# EAGLE design esp32buscam_01 (EAGLE 9.6.2)
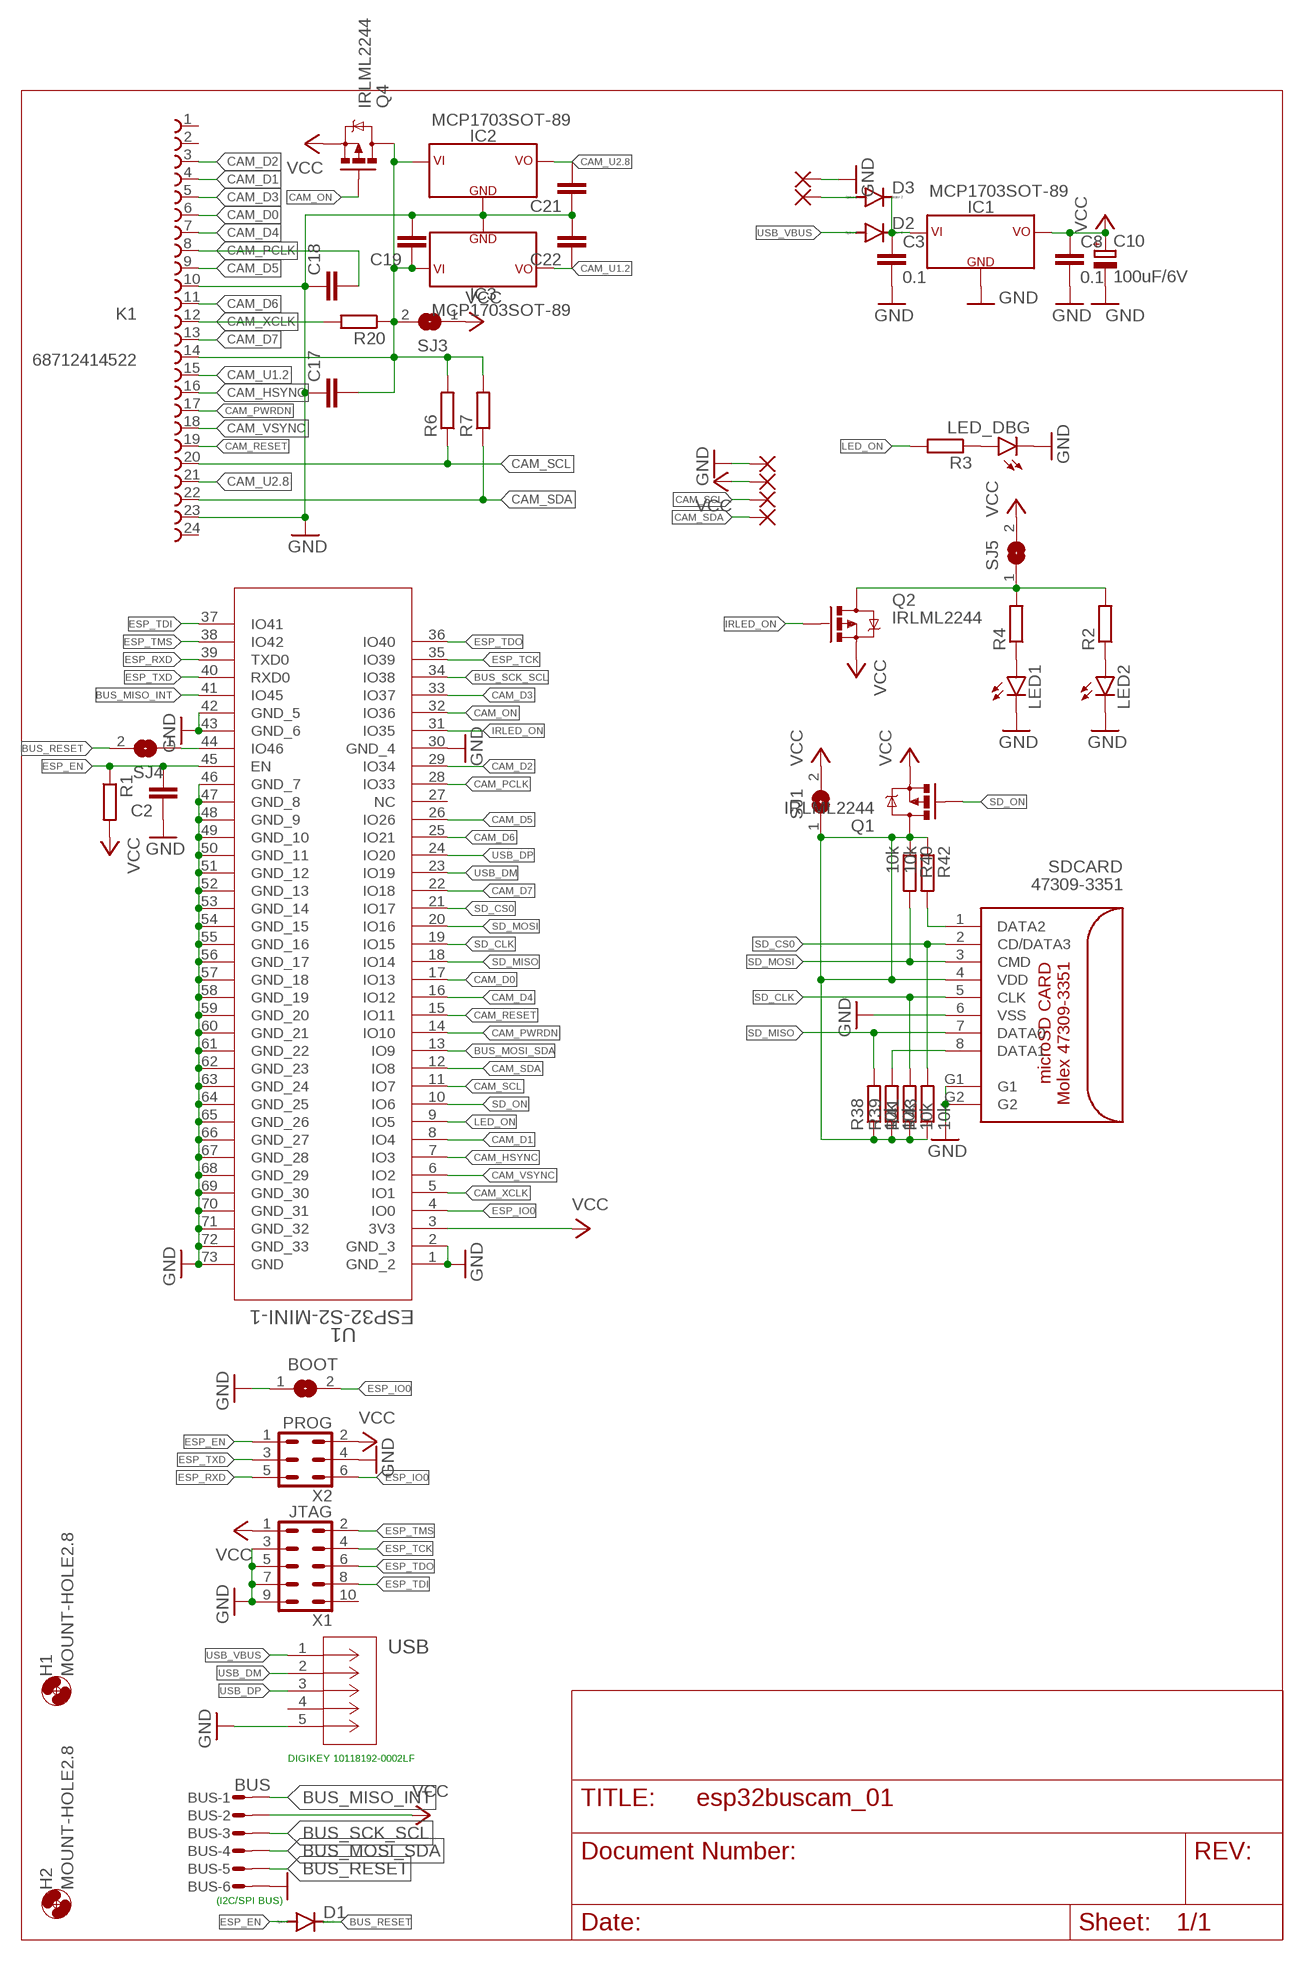
[diagram p0: schematic, sheet 1]

## Parts
BOOT  SJ  [SJ]
BUS  BUS  MICROMATCH-6SMD  [MICROMATCH-6SMD]
C2  C-EUC0603  [C0603]
C3  0.1  C-EUC0805  [C0805]
C8  0.1  C-EUC0805  [C0805]
C10  100uF/6V  CPOL-EUB/3528-21R  [B/3528-21R]
C17  C-EUC0603  [C0603]
C18  C-EUC0603  [C0603]
C19  C-EUC0603  [C0603]
C21  C-EUC0603  [C0603]
C22  C-EUC0603  [C0603]
D1  DIODE-MINIMELF  [MINIMELF]
D2  DIODE-MINIMELF  [MINIMELF]
D3  DIODE-MINIMELF  [MINIMELF]
H1  MOUNT-HOLE2.8  [2,8]
H2  MOUNT-HOLE2.8  [2,8]
IC1  MCP1703SOT-89  [SOT89]
IC2  MCP1703SOT-89  [SOT89]
IC3  MCP1703SOT-89  [SOT89]
K1  68712414522  [68712414522]
LED1  LED5MM  [LED5MM]
LED2  LED5MM  [LED5MM]
LED_DBG  G  LEDCHIPLED_0805  [CHIPLED_0805]
PAD1  1,6/0,9  [1,6/0,9]
PAD2  1,6/0,9  [1,6/0,9]
PAD3  1,6/0,9  [1,6/0,9]
PAD4  1,6/0,9  [1,6/0,9]
PAD5  1,6/0,9  [1,6/0,9]
PAD6  1,6/0,9  [1,6/0,9]
Q1  IRLML2244  MOSFET-PCHANNELIRLML2244  [SOT23-3]
Q2  IRLML2244  MOSFET-PCHANNELIRLML2244  [SOT23-3]
Q4  IRLML2244  MOSFET-PCHANNELIRLML2244  [SOT23-3]
R1  R-EU_R0603  [R0603]
R2  R-EU_R0402  [R0402]
R3  R-EU_R0402  [R0402]
R4  R-EU_R0402  [R0402]
R6  R-EU_R0603  [R0603]
R7  R-EU_R0603  [R0603]
R20  R-EU_R0603  [R0603]
R38  10k  R-EU_R0805  [R0805]
R39  10k  R-EU_R0805  [R0805]
R40  10k  R-EU_R0805  [R0805]
R41  10k  R-EU_R0805  [R0805]
R42  10k  R-EU_R0805  [R0805]
R43  10k  R-EU_R0805  [R0805]
SDCARD  47309-3351  [47309-3351]
SJ1  SJ  [SJ]
SJ3  SJ  [SJ]
SJ4  SJ  [SJ]
SJ5  SJ  [SJ]
U1  ESP32-S2-MINI-1  [QFN60_ESP32-S2-MINI-1_EXP]
USB  10118192-0002LF  [CONN_10118192-0002LF_AMP]
X1  JTAG  PHB_1MM27_2X05_SNS  [PHB_1MM27_2X05_SNS]
X2  PROG  PHB_1MM27_2X03_SNS  [PHB_1MM27_2X03_SNS]

## Nets
BUS_MISO_INT: BUS.1 U1.41(IO45)
BUS_MOSI_SDA: BUS.4 U1.13(IO9)
BUS_RESET: BUS.5 D1.C SJ4.2
BUS_SCK_SCL: BUS.3 U1.34(IO38)
CAM_D0: K1.6 U1.17(IO13)
CAM_D1: K1.4 U1.8(IO4)
CAM_D2: K1.3 U1.29(IO34)
CAM_D3: K1.5 U1.33(IO37)
CAM_D4: K1.7 U1.16(IO12)
CAM_D5: K1.9 U1.26(IO26)
CAM_D6: K1.11 U1.25(IO21)
CAM_D7: K1.13 U1.22(IO18)
CAM_HSYNC: K1.16 U1.7(IO3)
CAM_ON: Q4.1(G) U1.32(IO36)
CAM_PCLK: C18.2 K1.8 U1.28(IO33)
CAM_PWRDN: K1.17 U1.14(IO10)
CAM_RESET: K1.19 U1.15(IO11)
CAM_SCL: K1.20 PAD3.1(P) R6.1 U1.11(IO7)
CAM_SDA: K1.22 PAD4.1(P) R7.1 U1.12(IO8)
CAM_U1.2: C22.1 IC3.3(VCC) K1.15
CAM_U2.8: C21.2 IC2.3(VCC) K1.21
CAM_VSYNC: K1.18 U1.6(IO2)
CAM_XCLK: K1.12 R20.2 U1.5(IO1)
ESP_EN: C2.2 D1.A R1.1 U1.45(EN) X2.1
ESP_IO0: BOOT.2 U1.4(IO0) X2.6
ESP_RXD: U1.39(TXD0) X2.5
ESP_TCK: U1.35(IO39) X1.4
ESP_TDI: U1.37(IO41) X1.8
ESP_TDO: U1.36(IO40) X1.6
ESP_TMS: U1.38(IO42) X1.2
ESP_TXD: U1.40(RXD0) X2.3
GND [gnd]: BOOT.1 BUS.6 C2.1 C3.2 C8.2 C10.- C17.1 C18.1 C19.2 C21.1 C22.2 IC1.1(GND) IC2.1(GND) IC3.1(GND) K1.10 K1.23 LED1.K(C) LED2.K(C) LED_DBG.C PAD1.1(P) PAD6.1(P) SDCARD.6(VSS) SDCARD.G1 SDCARD.G2 U1.1(GND_2) U1.2(GND_3) U1.30(GND_4) U1.42(GND_5) U1.43(GND_6) U1.46(GND_7) U1.47(GND_8) U1.48(GND_9) U1.49(GND_10) U1.50(GND_11) U1.51(GND_12) U1.52(GND_13) U1.53(GND_14) U1.54(GND_15) U1.55(GND_16) U1.56(GND_17) U1.57(GND_18) U1.58(GND_19) U1.59(GND_20) U1.60(GND_21) U1.61(GND_22) U1.62(GND_23) U1.63(GND_24) U1.64(GND_25) U1.65(GND_26) U1.66(GND_27) U1.67(GND_28) U1.68(GND_29) U1.69(GND_30) U1.70(GND_31) U1.71(GND_32) U1.72(GND_33) U1.73(GND) USB.5 X1.3 X1.5 X1.7 X1.9 X2.4
IRLED_ON: Q2.1(G) U1.31(IO35)
LED_ON: R3.2 U1.9(IO5)
N$1: LED1.A R4.1
N$2: SJ4.1 U1.44(IO46)
N$3: LED2.A R2.1
N$4: LED_DBG.A R3.1
N$8: Q2.3(D) R2.2 R4.2 SJ5.1
SD_CLK: R41.2 SDCARD.5(CLK) U1.19(IO15)
SD_CS0: R43.2 SDCARD.2(CD/DATA3) U1.21(IO17)
SD_D1: R39.2 SDCARD.8(DATA1)
SD_D2: R42.2 SDCARD.1(DATA2)
SD_MISO: R38.2 SDCARD.7(DATA0) U1.18(IO14)
SD_MOSI: R40.2 SDCARD.3(CMD) U1.20(IO16)
SD_ON: Q1.1(G) U1.10(IO6)
U3.3 [power]: Q1.3(D) R38.1 R39.1 R40.1 R41.1 R42.1 R43.1 SDCARD.4(VDD) SJ1.1
USB_DM: U1.23(IO19) USB.2
USB_DP: U1.24(IO20) USB.3
USB_VBUS [power]: D2.A USB.1
V [power]: C3.1 D2.C D3.C IC1.2(VIN) IC1.4(VIN)
VCC [power]: BUS.2 C8.1 C10.+ IC1.3(VCC) PAD2.1(P) Q1.2(S) Q2.2(S) Q4.2(S) R1.2 SJ1.2 SJ3.1 SJ5.2 U1.3(3V3) X1.1 X2.2
VCC_CAM [power]: C17.2 C19.1 IC2.2(VIN) IC2.4(VIN) IC3.2(VIN) IC3.4(VIN) K1.14 Q4.3(D) R6.2 R7.2 R20.1 SJ3.2
VEXT: D3.A PAD5.1(P)
Unconnected: K1.1 K1.2 K1.24 U1.27(NC) USB.4 X1.10

## Notes on the sheet
- DIGIKEY 10118192-0002LF
- (I2C/SPI BUS)

## Library data of the parts
BOOT SJ1 SJ3-SJ5 = jumper:SJ: SMD solder JUMPER
BUS = con-amp-micromatch:MICROMATCH-6: MicroMaTch 6 7-215464-6 / 0-215464-6 Drawing Number C-215464 DDEController.pdf
C2 C17-C19 C21 C22 = rcl:C-EU: CAPACITOR, European symbol; SPICEPREFIX: C
C3 C8 = rcl:C-EU: CAPACITOR, European symbol
C10 = rcl:CPOL-EU: POLARIZED CAPACITOR, European symbol
D1-D3 = diode:DIODE-: DIODE
H1 H2 = holes:MOUNT-HOLE: MOUNTING HOLE with drill center marker
IC1-IC3 = bytewerk-vreg:MCP1703
K1 = FPC_Connectors_Flat_Flexible_Cable_rev15c:68712414522: WE-FPC 0.5mm SMT ZIF Horizontal Bottom Contact, 24 Pins=>Code : Con_FPC_ZIF_0.50_68712414522 <http://katalog.we-online.de/media/images/eican/Con_FPC_ZIF_0.50_6871xx14522_pf2.jpg> Details see: http://katalog.we-online.de/en/em/687_1xx_145_22 Created 2014-07-09, Karrer Zheng 2014 (C) Würth Elektronik
LED1 LED2 LED_DBG = led:LED: LED OSRAM: - CHIPLED LG R971, LG N971, LY N971, LG Q971, LY Q971, LO R971, LY R971 LH N974, LH R974 LS Q976, LO Q976, LY Q976 LO Q996 - Hyper CHIPLED LW Q18S LB Q993, LB Q99A, LB R99A - SideLED LS A670, LO A670, LY A670, LG A670, LP A670 LB A673, LV A673, LT A673, LW A673 LH A674 LY A675 LS A676, LA A676, LO A676, LY A676, LW A676 LS A679, LY A679, LG A679 - Hyper Micro SIDELED® LS Y876, LA Y876, LO Y876, LY Y876 LT Y87S - SmartLED LW L88C, LW L88S LB L89C, LB L89S, LG L890 LS L89K, LO L89K, LY L89K LS L896, LA L896, LO L896, LY L896 - TOPLED LS T670, LO T670, LY T670, LG T670, LP T670 LSG T670, LSP T670, LSY T670, LOP T670, LYG T670 LG T671, LOG T671, LSG T671 LB T673, LV T673, LT T673, LW T673 LH T674 LS T676, LA T676, LO T676, LY T676, LB T676, LH T676, LSB T676, LW T676 LB T67C, LV T67C, LT T67C, LS T67K, LO T67K, LY T67K, LW E67C LS E67B, LA E67B, LO E67B, LY E67B, LB E67C, LV E67C, LT E67C LW T67C LS T679, LY T679, LG T679 LS T770, LO T770, LY T770, LG T770, LP T770 LB T773, LV T773, LT T773, LW T773 LH T774 LS E675, LA E675, LY E675, LS T675 LS T776, LA T776, LO T776, LY T776, LB T776 LHGB T686 LT T68C, LB T68C - Hyper Mini TOPLED® LB M676 - Mini TOPLED Santana® LG M470 LS M47K, LO M47K, LY M47K Source: http://www.osram.convergy.de LUXEON: - LUMILED® LXK2-PW12-R00, LXK2-PW12-S00, LXK2-PW14-U00, LXK2-PW14-V00 LXK2-PM12-R00, LXK2-PM12-S00, LXK2-PM14-U00 LXK2-PE12-Q00, LXK2-PE12-R00, LXK2-PE12-S00, LXK2-PE14-T00, LXK2-PE14-U00 LXK2-PB12-K00, LXK2-PB12-L00, LXK2-PB12-M00, LXK2-PB14-N00, LXK2-PB14-P00, LXK2-PB14-Q00 LXK2-PR12-L00, LXK2-PR12-M00, LXK2-PR14-Q00, LXK2-PR14-R00 LXK2-PD12-Q00, LXK2-PD12-R00, LXK2-PD12-S00 LXK2-PH12-R00, LXK2-PH12-S00 LXK2-PL12-P00, LXK2-PL12-Q00, LXK2-PL12-R00 Source: www.luxeon.com KINGBRIGHT: KA-3528ASYC Source: www.kingbright.com
PAD1-PAD6 = wirepad:1,6/0,9: THROUGH-HOLE PAD
Q1 Q2 Q4 = User-Submitted:MOSFET-PCHANNEL: Generic PMOSFET IRLML2244 - TRANS-11153 (SOT-23 -20V -4.3A) (1.Gate 2.Source 3.Drain) FQP27P06 - COM-10349 <http://www.sparkfun.com/products/10349> (TO-220 -60V -27A) (1.Gate 2.Source 3.Drain); PROD_ID: TRANS-11153
R1-R4 R6 R7 R20 = rcl:R-EU_: RESISTOR, European symbol; SPICEPREFIX: R
R38-R43 = rcl:R-EU_: RESISTOR, European symbol
SDCARD = con-molex-microsd:47309-3351
U1 = esp32s2mini:ESP32-S2-MINI-1; BUILT_BY: EMA_Kyle; COPYRIGHT: Copyright (C) 2018 Accelerated Designs. All rights reserved; DATASHEET: https://www.espressif.com/sites/default/files/documentation/esp32-s2-mini-1_esp32-s2-mini-1u_datasheet_en.pdf; MANUFACTURER_PART_NUMBER: ESP32-S2-MINI-1; SOURCELIBRARY: Add_to_database_2020-11-03; VENDOR: Espressif Systems
USB = esp32s2mini:10118192-0002LF; BUILT_BY: EMA_Cory; COPYRIGHT: Copyright (C) 2018 Accelerated Designs. All rights reserved; DATASHEET: https://www.amphenol-icc.com/media/wysiwyg/files/drawing/10118192.pdf; MANUFACTURER_PART_NUMBER: 10118192-0002LF; SOURCELIBRARY: Amphenol_ICC_2020-05-19; VENDOR: Amphenol
X1 = _hhn_con_pinhead_box_1mm27:PHB_1MM27_2X05_*: Pin Header Box-Type, 1.27mm/0.5"/50mil Pitch, 2x05 Circuits Note: see library description for an important note about THT-version
X2 = _hhn_con_pinhead_box_1mm27:PHB_1MM27_2X03_*: Pin Header Box-Type, 1.27mm/0.5"/50mil Pitch, 2x03 Circuits Note: see library description for an important note about THT-version

## Net classes
0 default: width 0.089 mm, drill 0.2 mm
1 gnd: width 0.254 mm, drill 0.2 mm
2 power: width 0.254 mm, drill 0.2 mm

## Board
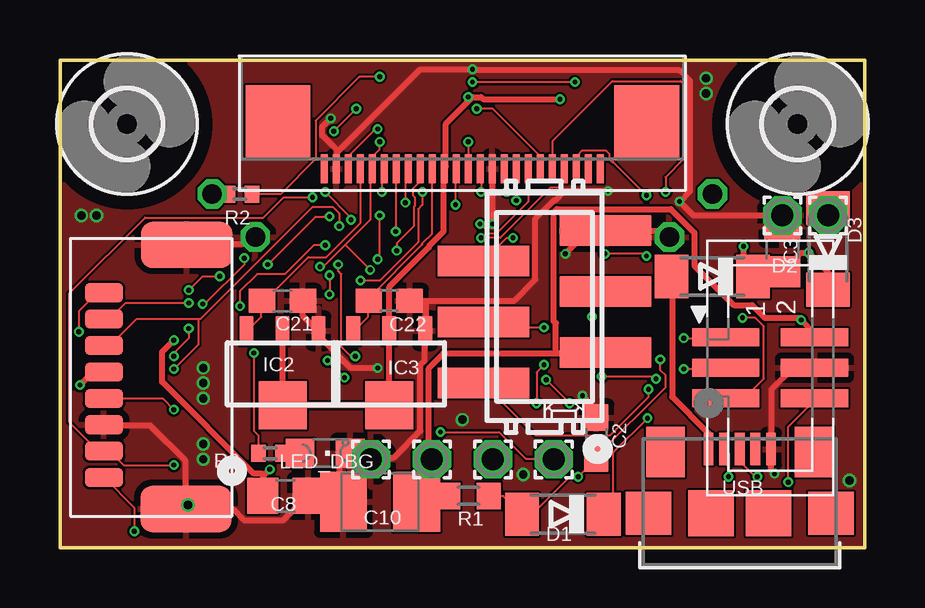
[diagram p1: board, top side]
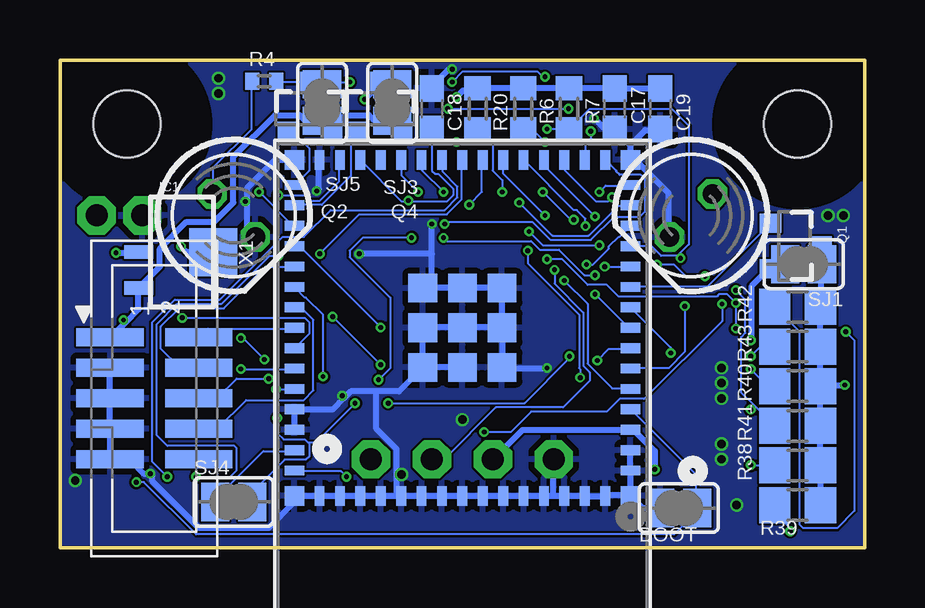
[diagram p2: board, bottom side, seen from below]

Size 33.53 x 20.32 mm. Coordinates in mm from the lower left corner, seen from the top.
Outline: 0,0 33.53,0 33.53,20.32 0,20.32 0,0
Copper layers (1*16): Top 0.035mm / dielectric 0.2mm / Bottom 0.035mm
Design rules "jlcpcb-2-layer *": minimum track width 3.5mil, minimum drill 0.2mm, track to track 3.5mil, track to pad 5mil, pad to pad 5mil, via to via 5mil, smd to smd 0mil, copper to edge 0.01mm, drill to drill 5mil, minimum pad ring 4mil, minimum via ring 4mil, stop-mask expansion 3mil, vias tented up to drill 100mil, thermal gap 10mil

### Footprints (pad centres in the part's own frame; a part is rotated, then mirrored left to right if it is on the bottom)
SJ = smd 1.168 x 1.6: 1 -0.762,0; 2 0.762,0
MICROMATCH-6SMD = smd 1.27 x 3.81: 1 3.175,-2.54; 2 1.905,2.54; 3 0.635,-2.54; 4 -0.635,2.54; 5 -1.905,-2.54; 6 -3.175,2.54
C0603 = smd 1.1 x 1: 1 -0.85,0; 2 0.85,0
C0805 = smd 1.3 x 1.5: 1 -0.95,0; 2 0.95,0
B/3528-21R = smd 1.95 x 2.5: + 1.525,0; - -1.525,0
MINIMELF = smd 1.4 x 1.8: A 1.7,0; C -1.7,0
2,8 = hole 2.8: 0,0
SOT89 = smd 0.58 x 1.2: 1 -1.5,-1.8; 2 0,-1.8; 3 1.5,-1.8 | smd 2 x 2: 4 0,1.3
68712414522 = smd 0.3 x 1.2: 1 -5.75,0.6; 2 -5.25,0.6; 3 -4.75,0.6; 4 -4.25,0.6; 5 -3.75,0.6; 6 -3.25,0.6; 7 -2.75,0.6; 8 -2.25,0.6; 9 -1.75,0.6; 10 -1.25,0.6; 11 -0.75,0.6; 12 -0.25,0.6; 13 0.25,0.6; 14 0.75,0.6; 15 1.25,0.6; 16 1.75,0.6; 17 2.25,0.6; 18 2.75,0.6; 19 3.25,0.6; 20 3.75,0.6; 21 4.25,0.6; 22 4.75,0.6; 23 5.25,0.6; 24 5.75,0.6 | smd 2.7 x 3: Z1 -7.68,-1.38; Z2 7.68,-1.38
LED5MM = drill 0.813 octagon: A -1.27,0; K 1.27,0
CHIPLED_0805 = smd 1.2 x 1.2: A 0,-1.05; C 0,1.05
1,6/0,9 = drill 0.914 pad 1.6 octagon: 1 0,0
SOT23-3 = smd 0.8 x 0.9: 1 -0.95,-1; 2 0.95,-1; 3 0,1.1
R0603 = smd 1 x 1.1: 1 -0.85,0; 2 0.85,0
R0402 = smd 0.6 x 0.7: 1 -0.5,0; 2 0.5,0
R0805 = smd 1.3 x 1.5: 1 -0.95,0; 2 0.95,0
47309-3351 = smd 0.8 x 1.6: 1 4.4,5.66; 2 3.3,5.66; 3 2.2,5.66; 4 1.1,5.66; 5 0,5.66; 6 -1.1,5.66; 7 -2.2,5.66; 8 -3.3,5.66 | smd 1.93 x 3.81: G1 -4.61,2.24; G2 6.393,2.217
QFN60_ESP32-S2-MINI-1_EXP = smd 0.813 x 0.406: 1 -7,3.645; 2 -7,2.795; 3 -7,1.945; 4 -7,1.095; 5 -7,0.245; 6 -7,-0.605; 7 -7,-1.455; 8 -7,-2.305; 9 -7,-3.155; 10 -7,-4.005; 11 -7,-4.855; 12 -7,-5.705; 13 -7,-6.555; 14 -7,-7.405; 15 -7,-8.255; 31 7,-8.255; 32 7,-7.405; 33 7,-6.555; 34 7,-5.705; 35 7,-4.855; 36 7,-4.005; 37 7,-3.155; 38 7,-2.305; 39 7,-1.455; 40 7,-0.605; 41 7,0.245; 42 7,1.095; 43 7,1.945; 44 7,2.795; 45 7,3.645 | smd 0.406 x 0.813: 16 -5.95,-9.305; 17 -5.1,-9.305; 18 -4.25,-9.305; 19 -3.4,-9.305; 20 -2.55,-9.305; 21 -1.7,-9.305; 22 -0.85,-9.305; 23 0,-9.305; 24 0.85,-9.305; 25 1.7,-9.305; 26 2.55,-9.305; 27 3.4,-9.305; 28 4.25,-9.305; 29 5.1,-9.305; 30 5.95,-9.305; 46 5.95,4.695; 47 5.1,4.695; 48 4.25,4.695; 49 3.4,4.695; 50 2.55,4.695; 51 1.7,4.695; 52 0.85,4.695; 53 0,4.695; 54 -0.85,4.695; 55 -1.7,4.695; 56 -2.55,4.695; 57 -3.4,4.695; 58 -4.25,4.695; 59 -5.1,4.695; 60 -5.95,4.695 | smd 1.194 x 1.194: 61 0,-2.305; 66 -1.65,-0.655; 67 0,-0.655; 68 1.65,-0.655; 69 -1.65,-2.305; 70 1.65,-2.305; 71 -1.65,-3.955; 72 0,-3.955; 73 1.65,-3.955 | smd 0.813 x 0.813: 62 -7,4.695; 63 -7,-9.305; 64 7,-9.305; 65 7,4.695
CONN_10118192-0002LF_AMP = smd 0.406 x 1.346: 1 -1.3,2.204; 2 -0.65,2.204; 3 0,2.204; 4 0.65,2.204; 5 1.3,2.204 | smd 1.6 x 2.108: 6 -3.1,2.079; 7 3.1,2.079 | smd 1.905 x 1.803: 8 -3.8,-0.471; 9 3.8,-0.471 | smd 1.905 x 1.905: 10 -1.2,-0.471; 11 1.2,-0.471
PHB_1MM27_2X05_SNS = smd 0.76 x 2.8: 1 -2.54,-1.85; 2 -2.54,1.85; 3 -1.27,-1.85; 4 -1.27,1.85; 5 0,-1.85; 6 0,1.85; 7 1.27,-1.85; 8 1.27,1.85; 9 2.54,-1.85; 10 2.54,1.85
PHB_1MM27_2X03_SNS = smd 0.76 x 2.8: 1 -1.27,-1.85; 2 -1.27,1.85; 3 0,-1.85; 4 0,1.85; 5 1.27,-1.85; 6 1.27,1.85

### Placement (x,y rotation side)
BOOT  7.75,1.65 0 bottom
BUS  20.19,10.03 270 top
C2  22.35,4.57 270 top
C3  30.1,12.45 90 top
C8  9.4,2.16 0 top
C10  13.34,1.91 0 top
C17  10.41,18.29 90 bottom
C18  18.03,18.29 270 bottom
C19  8.51,18.29 270 bottom
C21  9.27,10.29 180 top
C22  13.72,10.29 0 top
D1  20.95,1.4 180 top
D2  27.18,11.3 180 top
D3  32,12.45 90 top
H1  30.73,17.65 0 top
H2  2.79,17.65 0 top
IC1  28.45,12.32 270 bottom
IC2  9.27,7.24 180 top
IC3  13.72,7.24 180 top
K1  16.76,16.38 180 top
LED1  26.29,13.84 315 bottom
LED2  7.24,13.84 225 bottom
LED_DBG  11.05,3.94 270 top
PAD1  12.95,3.68 0 top
PAD2  15.49,3.68 0 top
PAD3  18.03,3.68 0 top
PAD4  20.57,3.68 0 top
PAD5  32,13.84 0 top
PAD6  30.1,13.84 0 top
Q1  2.92,12.57 270 bottom
Q2  23.11,18.29 0 bottom
Q4  20.19,18.29 0 bottom
R1  17.02,2.16 180 top
R2  7.49,14.73 0 top
R3  8.76,3.94 180 top
R4  25.02,19.43 0 bottom
R6  14.22,18.29 90 bottom
R7  12.32,18.29 90 bottom
R20  16.13,18.29 270 bottom
R38  2.79,3.43 180 bottom
R39  2.79,1.78 180 bottom
R40  2.79,6.73 180 bottom
R41  2.79,5.08 180 bottom
R42  2.79,10.03 180 bottom
R43  2.79,8.38 180 bottom
SDCARD  7.49,6.22 90 top
SJ1  2.54,11.81 180 bottom
SJ3  19.68,18.54 90 bottom
SJ4  26.29,1.91 0 bottom
SJ5  22.61,18.54 270 bottom
U1  16.76,6.86 180 bottom
USB  28.32,1.91 0 top
X1  29.59,6.22 270 bottom
X2  29.59,7.49 270 top

### Tracks (layer width: path | path; a pad name or v marks a point on that pad's centre or on a via)
BUS_MISO_INT  (via drill 0.2)
  Top 0.089: v24.52,6.6 24.52,6.29 22.92,4.69 19.81,4.69 17.68,6.82 BUS.1
  Bottom 0.089: v24.52,6.6 23.77,6.6 U1.41
BUS_MOSI_SDA  (via drill 0.2)
  Top 0.089: v11.59,11.8 11.59,11.53 11.72,11.4 11.72,8.38 12.12,7.98 v12.3,7.98 | v19.86,6.02 19.86,7.31 v20.17,7.62 | v22.17,9.62 22.17,10.11 22.7,10.64 BUS.4
  Bottom 0.089: v11.59,11.8 11.32,11.8 10.65,12.46 10.65,12.55 10.26,12.95 10.21,12.95 9.77,13.4 U1.13 | v12.3,7.98 12.3,7.89 14.17,6.02 v19.86,6.02 | v22.17,9.62 v20.17,7.62
BUS_RESET  (via drill 0.2)
  Top 0.089: v24.48,5.4 23.06,3.98 23.06,1.8 D1.C | v20.26,7 v21.23,6.02 | v18.88,12.91 18.61,12.91 17.68,11.98 BUS.5
  Bottom 0.089: 23.17,4.35 23.32,4.51 24.21,4.51 24.48,4.78 v24.48,5.4 | 23.17,4.35 23.15,4.33 23.15,3.8 23.28,3.66 24.17,3.66 25.5,2.33 25.5,1.93 SJ4.2 | v21.23,6.02 22.88,4.38 23.15,4.38 23.17,4.35 | v20.26,7 19.77,7.49 19.77,10.42 21.46,12.11 21.46,12.38 20.92,12.91 v18.88,12.91
BUS_SCK_SCL  (via drill 0.2)
  Top 0.089: v20.17,9.18 17.9,9.18 17.68,9.4 BUS.3
  Bottom 0.089: v20.17,9.18 23.55,12.55 23.72,12.55 U1.34
CAM_D0  (via drill 0.2)
  Top 0.089: v12.34,18.29 v11.41,17.36 | v17.37,18.29 18.03,18.29 19.99,16.33 19.99,15.8 K1.6
  Bottom 0.089: v11.41,17.36 11.41,17.04 11.63,16.82 11.63,16.2 U1.17 | v17.37,18.29 v12.34,18.29
CAM_D1  (via drill 0.2)
  Top 0.089: v11.23,11.35 v11.23,10.55 | v17.55,12.91 18.34,12.91 20.43,15 20.75,15 21.01,15.27 21.01,15.75 K1.4
  Bottom 0.089: v11.23,10.55 9.86,9.18 9.77,9.18 U1.8 | v11.23,11.35 11.68,11.35 12.74,12.42 13.54,12.42 13.9,12.78 17.41,12.78 v17.55,12.91
CAM_D2  (via drill 0.2)
  Top 0.089: v24.43,14.69 23.06,16.07 23.01,16.07 22.88,16.2 22.88,16.42 22.75,16.55 21.77,16.55 21.55,16.33 21.55,15.8 K1.3
  Bottom 0.089: v24.43,14.69 23.32,14.69 23.1,14.46 22.7,14.46 21.9,15.27 21.9,16.15 U1.29
CAM_D3  (via drill 0.2)
  Top 0.089: v25.23,14.82 25.23,15.44 25.99,16.2 25.99,19.31 25.86,19.44 23.01,19.44 20.52,16.95 20.52,15.8 K1.5
  Bottom 0.089: v25.23,14.82 23.86,13.44 23.77,13.44 U1.33
CAM_D4  (via drill 0.2)
  Top 0.089: v17.5,13.49 17.9,13.09 18.17,13.09 19.5,14.42 19.5,15.75 K1.7
  Bottom 0.089: v17.5,13.49 17.41,13.58 13.86,13.58 13.1,12.82 11.41,12.82 10.43,13.8 9.37,13.8 9.14,14.02 9.14,15.35 9.32,15.53 10.21,15.53 10.34,15.66 10.34,15.71 10.79,16.15 U1.16
CAM_D5  (via drill 0.2)
  Top 0.089: v18.61,14.82 18.61,15.66 18.52,15.75 K1.9
  Bottom 0.089: v18.61,14.82 19.28,15.49 19.28,16.15 U1.26
CAM_D6  (via drill 0.2)
  Top 0.089: v17.55,14.82 17.55,15.75 K1.11
  Bottom 0.089: v17.55,14.82 18.43,15.71 18.43,16.15 U1.25
CAM_D7  (via drill 0.2)
  Top 0.089: v16.48,14.29 16.48,15.75 K1.13
  Bottom 0.089: v16.48,14.29 15.95,14.82 15.95,16.15 U1.22
CAM_HSYNC  (via drill 0.2)
  Top 0.089: v11.86,7.09 v11.14,7.8 | v14.03,12.38 14.03,12.69 14.74,13.4 14.74,14.2 14.79,14.24 14.79,14.6 14.7,14.69 14.7,14.95 15.01,15.27 15.01,15.75 K1.16
  Bottom 0.089: v11.14,7.8 10.65,8.29 9.77,8.29 U1.7 | v11.86,7.09 11.86,7.44 11.9,7.49 11.9,9.71 14.03,11.84 v14.03,12.38
CAM_ON
  Bottom 0.089: U1.32 23.72,14.29 22.61,14.29 21.41,15.49 21.41,17 21.14,17.27 Q4.1
CAM_PCLK  (via drill 0.2)
  Top 0.089: v19.01,14.46 19.01,15.75 K1.8
  Bottom 0.089: 19.01,14.42 17.41,14.42 17.14,14.69 17.14,14.95 17.77,15.58 17.9,15.58 18.03,15.71 C18.2 | 19.01,14.42 19.28,14.42 U1.28 | 19.01,14.42 v19.01,14.46
CAM_PWRDN  (via drill 0.2)
  Top 0.089: v14.39,14.38 14.39,15.66 14.48,15.75 K1.17
  Bottom 0.089: v14.39,14.38 13.01,13 11.5,13 10.26,14.24 9.77,14.24 U1.14
CAM_RESET  (via drill 0.2)
  Top 0.089: v11.05,14.82 12.12,13.75 v12.12,13.66 | v13.41,14.82 13.41,15.66 13.5,15.75 K1.19
  Bottom 0.089: v11.05,14.82 10.79,15.09 9.77,15.09 U1.15 | v12.12,13.66 12.26,13.66 v13.41,14.82
CAM_SCL  (via drill 0.2)
  Top 0.089: v10.83,11.71 10.97,11.71 11.88,12.62 | 11.88,12.62 12.92,13.66 12.92,15.66 13.01,15.75 K1.20 13.06,15.8 13.06,16.33 13.32,16.6 v13.32,16.91 | 11.88,12.62 v12.92,11.58
  Bottom 0.089: v10.83,11.71 U1.11 | v13.32,16.91 13.81,17.4 14.21,17.4 R6.1 | v12.92,11.58 12.92,11 11.72,9.8 11.72,7.58 11.46,7.31 11.46,6.95 12.57,5.84 15.37,5.84 17.5,3.71 18.03,3.71 PAD3.1
CAM_SDA  (via drill 0.2)
  Top 0.089: v13.23,17.44 13.14,17.44 12.03,16.33 12.03,15.8 K1.22 | v15.86,4.82 18.3,4.82 19.41,3.71 20.57,3.71 PAD4.1 | v5.94,10.15 6.03,10.15 7.68,11.8 v7.68,12.06
  Bottom 0.089: 7.79,12.18 7.32,12.64 7.32,17.58 8.03,18.29 11.46,18.29 12.3,17.44 R7.1 12.34,17.44 v13.23,17.44 | 7.79,12.18 7.81,12.15 8.48,12.15 8.88,12.55 9.72,12.55 U1.12 | v15.86,4.82 14.74,4.82 13.9,5.66 10.74,5.66 10.21,6.2 9.19,6.2 5.94,9.44 v5.94,10.15 | 7.79,12.18 v7.68,12.06
CAM_U1.2
  Top 0.089: IC3.3 12.26,9.04 12.83,9.62 12.83,10.29 C22.1 12.88,10.42 15.1,12.64 15.1,12.69 15.5,13.09 15.5,15.75 K1.15
CAM_U2.8
  Top 0.089: IC2.3 7.81,9.04 8.39,9.62 8.39,10.29 C21.2 8.52,10.29 10.34,12.11 11.1,12.11 12.52,13.53 12.52,15.75 K1.21
CAM_VSYNC  (via drill 0.2)
  Top 0.089: v7.5,10.06 7.5,10.69 8.21,11.4 9.37,11.4 10.57,12.6 v11.05,12.6 | v13.99,13.18 13.99,15.75 K1.18
  Bottom 0.089: v7.5,10.06 7.5,8.15 8.17,7.49 9.72,7.49 U1.6 | v11.05,12.6 13.41,12.6 v13.99,13.18
CAM_XCLK  (via drill 0.2)
  Top 0.089: v12.52,11.13 13.32,11.13 14.92,12.73 14.92,14.11 15.1,14.29 v15.1,14.82 | v17.01,16.91 17.01,15.8 K1.12
  Bottom 0.089: v12.52,11.13 11.54,10.15 11.54,7.66 10.52,6.64 9.77,6.64 U1.5 | v15.1,14.82 15.1,15.31 15.5,15.71 15.5,16.78 16.12,17.4 R20.2 16.17,17.4 16.66,16.91 v17.01,16.91
ESP_EN  (via drill 0.2)
  Top 0.089: R1.1 17.9,2.15 18.48,2.15 19.23,1.4 D1.A 19.68,1.4 21.23,2.95 v21.59,2.95 22.35,3.71 C2.2 22.39,3.75 22.39,3.84 25.23,6.69 25.23,7.18 25.01,7.4 v25.01,7.84 | v25.99,8.73 27.72,8.73 X2.1
  Bottom 0.089: v21.59,2.95 21.81,3.17 23.72,3.17 U1.45 | v25.99,8.73 25.9,8.73 v25.01,7.84
ESP_IO0  (via drill 0.2)
  Top 0.089: v30.35,2.73 30.35,5.04 31.41,6.11 31.41,6.2 X2.6
  Bottom 0.089: U1.4 9.72,5.75 7.01,3.04 7.01,1.66 BOOT.2 7.01,1.62 7.01,1.49 7.94,0.55 27.86,0.55 30.04,2.73 v30.35,2.73
ESP_RXD  (via drill 0.2)
  Top 0.089: v28.43,9.58 28.97,9.58 29.32,9.22 29.32,7.04 28.52,6.24 27.77,6.24 X2.5
  Bottom 0.089: v28.43,9.58 23.32,9.58 23.15,9.4 23.15,8.91 23.72,8.33 U1.39
ESP_TCK
  Bottom 0.089: U1.35 24.97,11.71 26.7,9.98 28.57,9.98 29.32,9.22 29.32,8.29 28.57,7.53 27.77,7.53 X1.4
ESP_TDI
  Bottom 0.089: X1.8 26.97,4.95 25.77,6.15 23.37,6.15 22.97,6.55 22.97,9.49 23.46,9.98 23.72,9.98 U1.37
ESP_TDO  (via drill 0.2)
  Top 0.089: v22.57,7.13 24.75,7.13 v24.84,7.04
  Bottom 0.089: v22.57,7.13 22.57,9.71 23.28,10.42 23.32,10.42 23.72,10.82 U1.36 | v24.84,7.04 26.17,7.04 26.97,6.24 27.72,6.24 X1.6
ESP_TMS
  Bottom 0.089: U1.38 23.77,9.13 27.37,9.13 27.72,8.78 X1.2
ESP_TXD  (via drill 0.2)
  Top 0.089: v25.99,7.44 27.68,7.44 27.72,7.49 X2.3
  Bottom 0.089: v25.99,7.44 23.77,7.44 U1.40
GND  (via drill 0.2, 0.35)
  Top 0.254: SDCARD.G2 5.28,12.64 7.86,12.64 8.12,12.91 LED2.K | 11.59,16.51 11.54,16.47 11.54,15.8 K1.23 | 11.59,16.51 15.01,19.93 v17.19,19.93 17.28,19.89 25.81,19.89 26.26,19.44 26.26,14.87 v25.81,14.42 26.39,13.84 PAD6.1 30.12,13.84 30.12,13.4 C3.2 | LED1.K 25.37,12.95 25.15,13.18 22.75,13.18 BUS.6 22.61,13.18 21.99,13.18 v21.06,12.24 | v11.28,17.89 10.92,17.53 10.92,17.18 11.59,16.51 | v21.77,6.33 22.35,5.75 22.35,5.44 C2.1 | C21.1 10.12,9.66 10.74,9.04 IC2.1 10.79,8.91 10.79,8.82 12.12,7.49 v13.23,7.49 | v18.03,13.49 18.03,15.75 K1.10 | v22.84,14.87 21.01,14.87 20.61,14.46 20.57,14.46 19.81,13.71 19.81,11.18 18.92,10.29 15.23,10.29 | C22.2 15.23,10.29 | 15.23,10.29 15.23,9.04 IC3.1 15.19,8.91 15.19,7.8 15.01,7.62 15.01,4.86 13.9,3.75 13.06,3.75 PAD1.1 12.92,3.71 12.7,3.93 12.12,3.93 LED_DBG.C 12.03,3.84 11.63,3.44 11.63,2.24 C10.- 11.77,1.93 11.54,2.15 10.39,2.15 C8.2 10.26,2.11 9.28,1.13 7.68,1.13 7.23,1.57 5.37,1.57 SDCARD.G1 5.23,1.62 5.23,3.62 3.77,5.09 1.85,5.09 SDCARD.6 | X1.3 31.41,7.49 30.52,7.49 29.64,6.6 29.64,4.15 USB.5 29.64,3.98 29.64,3.22 v29.77,3.09
  Bottom 0.254: 9.77,16.78 9.77,16.2 U1.63 9.68,16.11 9.5,16.11 8.17,14.78 8.17,12.95 LED2.K | 9.77,16.78 10.39,17.4 C17.1 10.52,17.49 10.88,17.49 v11.28,17.89 | 9.77,16.78 9.14,17.4 8.52,17.4 C19.2 | v17.19,19.93 17.32,19.93 17.68,19.58 17.68,19.53 18.03,19.18 C18.1 | PAD6.1 30.21,13.84 IC1.1 | 25.72,14.42 25.72,13.27 25.41,12.95 LED1.K | 25.72,14.42 25.72,15 24.57,16.15 U1.64 | v25.81,14.42 25.72,14.42 | U1.43 23.77,4.95 U1.42 23.64,5.75 22.17,5.75 21.68,6.24 | 21.68,6.24 21.41,6.51 20.34,6.51 | 20.34,6.51 19.41,6.51 18.43,7.49 U1.68 | v21.77,6.33 21.68,6.24 | U1.67 16.79,7.53 18.3,7.53 U1.68 | U1.69 15.1,9.13 15.1,7.53 U1.66 15.01,7.49 v13.23,7.49 | U1.69 15.23,9.18 16.75,9.18 U1.61 16.88,9.18 18.39,9.18 U1.70 18.43,9.04 18.43,7.62 U1.68 | U1.69 15.1,9.27 15.1,10.78 U1.71 15.23,10.82 16.75,10.82 U1.72 16.88,10.82 18.39,10.82 U1.73 18.03,10.91 18.03,12.24 | 18.03,12.24 v18.03,13.49 | v22.84,14.87 22.75,14.95 22.75,16.15 U1.30 | X1.3 31.46,7.49 31.46,6.33 X1.5 31.46,6.2 31.46,5.04 X1.7 31.46,4.95 31.46,3.71 X1.9 31.32,3.62 30.57,3.62 30.04,3.09 v29.77,3.09 29.68,3 29.68,2.77 27.72,0.82 24.84,0.82 23.81,1.84 23.81,2.06 U1.65 23.72,2.15 22.84,2.15 U1.46 21.99,2.15 U1.47 21.1,2.15 U1.48 20.26,2.15 U1.49 20.12,2.15 19.41,2.15 U1.50 | U1.62 9.77,2.2 9.77,3.17 U1.1 9.77,3.31 9.77,4.02 U1.2 | 12.97,2.15 12.61,2.15 U1.58 12.48,2.15 11.77,2.15 U1.59 11.63,2.15 10.83,2.15 U1.60 10.7,2.2 9.86,2.2 U1.62 | 12.97,2.15 13.32,2.15 U1.57 13.46,2.15 U1.56 14.3,2.15 U1.55 15.19,2.15 U1.54 16.03,2.15 16.75,2.15 U1.53 16.88,2.15 17.59,2.15 U1.52 17.72,2.15 18.43,2.15 U1.51 18.57,2.15 19.28,2.15 U1.50
  Bottom 0.254: BOOT.1 8.52,1.66 9.28,1.66 9.68,2.06 U1.62 | 12.97,2.15 12.97,3.66 PAD1.1 | 20.34,6.51 20.34,4.95 19.5,4.11 19.5,2.24 U1.50 | 18.03,12.24 v21.06,12.24
  other vias: 1.52,13.84 0.89,13.84 5.97,4.32 5.97,3.68 5.33,1.78 26.92,19.56 26.92,18.92 32.89,2.79 5.97,7.49 5.97,6.86 5.97,6.22 16.76,5.33 19.3,3.05
  pour Top: 0,0 33.53,0 33.53,20.32 0,20.32
  pour Bottom: 0,0 33.53,0 33.53,20.32 0,20.32
IRLED_ON
  Bottom 0.089: U1.31 23.72,15.13 23.15,15.71 23.15,16.64 23.77,17.27 24.04,17.27 Q2.1
LED_ON  (via drill 0.2)
  Top 0.089: v8.08,8.11 8.08,4.86 8.26,4.69 8.26,3.98 R3.2
  Bottom 0.089: v8.08,8.11 8.08,8.33 9.72,9.98 U1.9
N$1
  Bottom 0.089: R4.1 25.55,19.4 25.55,17.44 27.15,15.84 27.15,14.78 LED1.A
N$2
  Bottom 0.089: U1.44 23.77,4.02 25.06,4.02 27.01,2.06 27.01,1.93 SJ4.1
N$3
  Top 0.089: R2.1 LED2.A
N$4
  Top 0.089: R3.1 9.28,3.93 LED_DBG.A
N$8  (via drill 0.2)
  Top 0.089: R2.2 9.19,14.73 10.65,16.2 10.65,17.8 12.48,19.62 v13.32,19.62 | v21.46,19.4 v17.19,19.4
  Bottom 0.089: v13.32,19.62 13.41,19.62 13.63,19.84 16.75,19.84 v17.19,19.4 | v21.46,19.4 22.48,19.4 22.57,19.31 SJ5.1 23.15,19.4 | 23.15,19.4 24.48,19.4 R4.2 | 23.15,19.4 Q2.3
SD_CLK  (via drill 0.2)
  Top 0.089: v11.23,13.8 10.65,13.8 v8.65,11.8 | v6.66,11.31 5.94,11.31 v5.37,10.73 | v4.74,5.75 4.3,6.2 1.85,6.2 SDCARD.5
  Bottom 0.089: v11.23,13.8 13.32,15.89 13.32,16.15 U1.19 | v8.65,11.8 7.94,11.8 7.46,11.31 v6.66,11.31 | v5.37,10.73 4.97,10.33 4.97,8.95 5.14,8.78 5.14,6.46 4.59,5.91 | 4.59,5.91 3.77,5.09 R41.2 | 4.59,5.91 v4.74,5.75
SD_CS0  (via drill 0.2)
  Top 0.089: v13.32,13.84 13.32,12.11 v13.23,12.02 | v5.37,10.2 2.74,10.2 2.08,9.53 1.85,9.53 SDCARD.2 | v4.74,7.98 4.74,8.11 5.37,8.73 v5.37,9.13
  Bottom 0.089: v13.32,13.84 15.06,15.58 U1.21 | v13.23,12.02 12.61,12.02 11.54,10.95 10.74,10.95 10.26,10.46 6.17,10.46 6.08,10.55 5.72,10.55 v5.37,10.2 v5.37,9.13 | v4.74,7.98 4.34,8.38 3.77,8.38 R43.2
SD_D1  (via drill 0.2)
  Top 0.089: v3.1,0.69 3.1,1.66 1.85,2.91 SDCARD.8
  Bottom 0.089: v3.1,0.69 3.1,0.81 3.72,1.44 3.72,1.75 R39.2
SD_D2  (via drill 0.2)
  Top 0.089: v0.79,9 0.79,9.84 1.54,10.6 1.81,10.6 SDCARD.1
  Bottom 0.089: v0.79,9 0.43,8.64 0.43,1.53 1.14,0.82 2.56,0.82 2.7,0.95 2.7,9 3.72,10.02 R42.2
SD_MISO  (via drill 0.2)
  Top 0.089: v10.52,14.6 9.32,14.6 8.48,13.75 3.54,13.75 0.39,10.6 0.39,5.22 1.54,4.06 1.81,4.06 SDCARD.7 1.85,4.02 2.08,4.02 2.65,3.44 v4.74,3.44
  Bottom 0.089: v10.52,14.6 10.7,14.42 11.19,14.42 12.48,15.71 12.48,16.15 U1.18 | v4.74,3.44 3.77,3.44 R38.2
SD_MOSI  (via drill 0.2)
  Top 0.089: v11.63,13.4 11.63,13.93 11.37,14.2 10.52,14.2 5.86,9.53 5.77,9.53 | 5.77,9.53 3.19,9.53 2.12,8.46 1.85,8.46 SDCARD.3 | v4.74,7.44 5.77,8.46 5.77,9.53
  Bottom 0.089: v11.63,13.4 11.63,13.71 11.99,14.06 12.12,14.06 U1.20 | R40.2 4.03,6.73 v4.74,7.44
SD_ON
  Bottom 0.089: U1.10 9.72,10.87 6.57,10.87 3.94,13.49 Q1.1
U3.3  (via drill 0.2)
  Top 0.254: v0.83,6.78 1.36,7.31 1.81,7.31 SDCARD.4
  Bottom 0.254: Q1.3 1.81,12.55 1.81,11.84 SJ1.1 1.81,11.71 1.81,10.15 R42.1 1.85,10.02 1.85,8.51 R43.1 1.85,8.38 1.85,6.82 R40.1 | R39.1 1.85,1.8 1.85,3.4 R38.1 1.85,3.53 1.85,5.04 R41.1 1.85,5.17 1.85,6.73 R40.1 | v0.83,6.78 1.72,6.78 R40.1
USB_DM  (via drill 0.2)
  Top 0.089: v22.7,12.24 24.35,12.24 v24.43,12.15 | v27.86,2.95 27.86,3.93 USB.2
  Bottom 0.089: v22.7,12.24 21.06,13.89 17.41,13.89 16.79,14.51 16.79,16.15 U1.23 | v24.43,12.15 24.79,12.15 26.79,10.15 28.66,10.15 29.5,9.31 29.5,4.69 29.06,4.24 26.26,4.24 26.17,4.15 26.17,3.22 26.43,2.95 v27.86,2.95
USB_DP  (via drill 0.2)
  Top 0.089: v29.06,2.95 28.97,2.95 28.35,3.58 28.35,4.11 USB.3
  Bottom 0.089: v29.06,2.95 29.68,3.58 29.68,9.4 28.75,10.33 26.88,10.33 24.26,12.95 23.37,12.95 22.26,14.06 17.5,14.06 16.97,14.6 16.97,15.04 17.59,15.66 17.59,16.15 U1.24
USB_VBUS
  Top 0.254: USB.1 27.01,4.15 27.01,4.78 25.5,6.29 25.5,11.27 D2.A
V  (via drill 0.2)
  Top 0.254: D3.C 31.99,10.78 31.99,11.49 v31.19,12.29 30.88,12.29 30.12,11.53 C3.1 29.99,11.44 29.01,11.44 D2.C 28.92,11.53 28.48,11.98 v28.48,12.55
  Bottom 0.254: v31.19,12.29 30.26,12.29 IC1.2 | v28.48,12.55 28.26,12.33 27.19,12.33 IC1.4
VCC  (via drill 0.2)
  Top 0.254: X1.1 31.41,8.78 31.41,8.95 v30.88,9.49 30.79,9.58 29.37,9.58 28.84,10.11 28.08,10.11 26.43,11.75 26.43,13.13 25.46,14.11 20.7,14.11 20.57,13.98 20.57,9.44 20.66,9.35 20.66,8.11 | R1.2 15.1,2.15 14.88,1.93 C10.+ 15.5,2.24 15.5,3.66 PAD2.1 15.46,3.8 15.37,3.89 15.37,7.49 15.99,8.11 20.66,8.11 | 8.48,3 8.48,2.2 C8.1 | v8.74,3.26 8.48,3 | v4.74,8.64 4.25,8.15 4.25,6.91 8.08,3.09 8.39,3.09 8.48,3 | 20.66,8.11 22.7,8.11 BUS.2
  Bottom 0.254: Q4.2 19.28,17.31 19.72,17.75 SJ3.1 19.81,17.84 20.48,17.84 20.66,18.02 21.63,18.02 22.17,17.49 Q2.2 22.17,17.31 22.61,17.75 SJ5.2 22.7,17.84 23.37,17.84 23.55,18.02 24.57,18.02 26.3,16.29 26.3,14.38 27.1,13.58 28.26,13.58 29.37,12.46 29.37,11.71 30.17,10.91 IC1.3 30.26,10.78 30.26,9.93 30.79,9.4 | 30.79,9.4 31.41,8.78 X1.1 | v30.88,9.49 30.79,9.4 | SJ1.2 3.32,11.8 3.45,11.66 3.9,11.66 Q1.2 4.03,11.58 4.7,10.91 4.7,8.69 v4.74,8.64 | PAD2.1 15.46,3.71 14.26,4.91 U1.3 9.63,4.91 8.74,4.02 v8.74,3.26
VCC_CAM  (via drill 0.2)
  Top 0.254: IC2.2 9.28,9 9.28,5.97 IC2.4 9.37,5.93 13.59,5.93 IC3.4 13.72,5.97 13.72,9 IC3.2 13.72,9.13 13.72,10.87 15.37,12.51 15.37,12.55 15.99,13.18 15.99,15.75 K1.14 16.08,15.89 16.08,17.67 17.1,18.69 | v20.83,18.69 17.63,18.69 17.55,18.78 17.19,18.78 17.1,18.69 | v17.01,18.78 17.1,18.69
  Bottom 0.254: C19.1 8.52,19.13 10.39,19.13 C17.2 10.52,19.13 12.3,19.13 R7.2 12.43,19.13 R6.2 14.35,19.13 R20.1 16.21,19.04 16.75,19.04 v17.01,18.78 | SJ3.2 19.72,19.31 19.77,19.36 20.17,19.36 Q4.3 20.26,19.27 v20.83,18.69
VEXT
  Top 0.089: D3.A 32.04,14.11 32.04,13.84 PAD5.1